# Altium schematic sheet Microcontroller_sch_v22_4.SchDoc
size 286 x 127 mm; Origin: Eagle
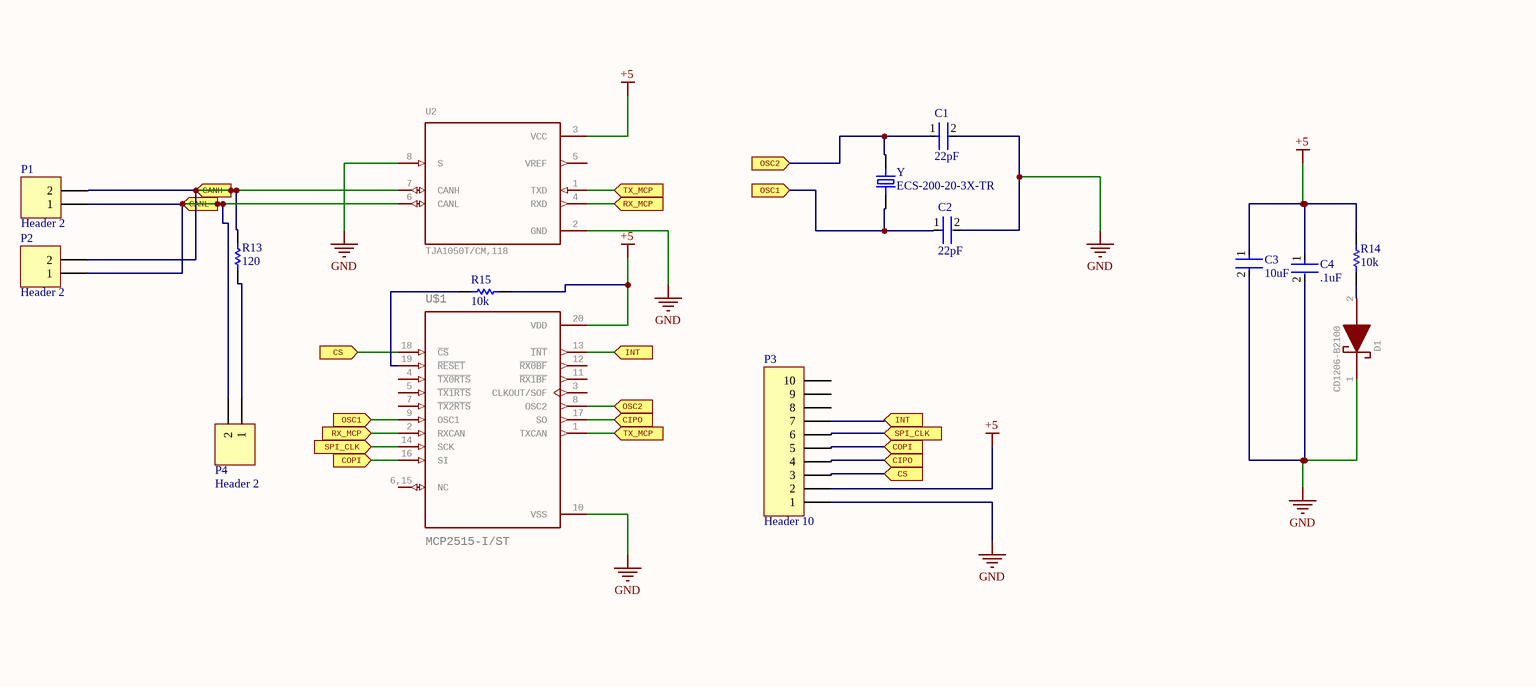
[diagram p0: Microcontroller_sch_v22_4.SchDoc]

## Parts
C1  22pF  [FP-GRM21B-0_15-IPC_C]
C2  22pF  [FP-GRM21B-0_15-IPC_C]
C3  10uF  [FP-GRM21B-0_15-IPC_C]
C4  .1uF  [FP-GRM21B-0_15-IPC_C]
D1  CD1206-B2100  [DIOC3419X116N]
P1  Header 2  [HDR1X2]
P2  Header 2  [HDR1X2]
P3  Header 10  [HDR1X10]
P4  Header 2  [HDR1X2]
R13  120  [RESC2013X50X30LL20T20]
R14  10k  [RESC2013X50X30LL20T20]
R15  10k  [RESC2013X50X30LL20T20]
U2  TJA1050T/CM,118  [SOIC127P600X175-8N]
U$1  MCP2515-I/ST  [SOP65P640X110-20N]
Y  ECS-200-20-3X-TR  [XTAL_ECS-200-20-3X-TR]

## Ports
CANH (in, see Microcontroller_sch_v22_2[4B]), CANL (in, see Microcontroller_sch_v22_2[4B]), CIPO (in, see Microcontroller_sch_v22_0[1B], Microcontroller_sch_v22_1[1B], Microcontroller_sch_v22_1[5C], Microcontroller_sch_v22_4[3C]), CIPO (in, see Microcontroller_sch_v22_0[1B], Microcontroller_sch_v22_1[1B], Microcontroller_sch_v22_1[5C], Microcontroller_sch_v22_4[4C]), COPI (in, see Microcontroller_sch_v22_0[1B], Microcontroller_sch_v22_1[1B], Microcontroller_sch_v22_1[5C], Microcontroller_sch_v22_4[2C]), COPI (in, see Microcontroller_sch_v22_0[1B], Microcontroller_sch_v22_1[1B], Microcontroller_sch_v22_1[5C], Microcontroller_sch_v22_4[4C]), CS (in, see Microcontroller_sch_v22_4[2C]), CS (in, see Microcontroller_sch_v22_4[4C]), INT (in, see Microcontroller_sch_v22_4[3C]), INT (in, see Microcontroller_sch_v22_4[4C]), OSC1 (in, see Microcontroller_sch_v22_4[2C]), OSC1 (in, see Microcontroller_sch_v22_4[3B]), OSC2 (in, see Microcontroller_sch_v22_4[3A]), OSC2 (in, see Microcontroller_sch_v22_4[3C]), RX_MCP (in, see Microcontroller_sch_v22_4[2C]), RX_MCP (in, see Microcontroller_sch_v22_4[3B]), SPI_CLK (in, see Microcontroller_sch_v22_0[1B], Microcontroller_sch_v22_1[0B], Microcontroller_sch_v22_1[4C], Microcontroller_sch_v22_2[4B], Microcontroller_sch_v22_4[2C]), SPI_CLK (in, see Microcontroller_sch_v22_0[1B], Microcontroller_sch_v22_1[0B], Microcontroller_sch_v22_1[4C], Microcontroller_sch_v22_2[4B], Microcontroller_sch_v22_4[4C]), TX_MCP (in, see Microcontroller_sch_v22_4[3B]), TX_MCP (in, see Microcontroller_sch_v22_4[3C])

## Nets
+5: C3.1 C4.1 P3.2 R14.1 R15.1 U2.3(VCC) U$1.20(VDD)
GND: C1.2 C2.2 C3.2 C4.2 D1.1(K) P3.1 U2.2(GND) U2.8(S) U$1.10(VSS)
CANH: P1.2 P2.2 R13.2 U2.7(CANH) ; port CANH
CANL: P1.1 P2.1 P4.2 U2.6(CANL) ; port CANL
CIPO: P3.4 U$1.17(SO) ; port CIPO
COPI: P3.5 U$1.16(SI) ; port COPI
CS: P3.3 U$1.18(~{CS}) ; port CS
INT: P3.7 U$1.13(~{INT}) ; port INT
OSC1: C2.1 U$1.9(OSC1) Y.1 ; port OSC1
OSC2: C1.1 U$1.8(OSC2) Y.2 ; port OSC2
RX_MCP: U2.4(RXD) U$1.2(RXCAN) ; port RX_MCP
SPI_CLK: P3.6 U$1.14(SCK) ; port SPI_CLK
TX_MCP: U2.1(TXD) U$1.1(TXCAN) ; port TX_MCP
NetD1_2: D1.2(A) R14.2
NetP4_1: P4.1 R13.1
NetR15_2: R15.2 U$1.19(~{RESET})

Not connected (* = marked no-connect by the designer): P3 8 9 10; U2 5(VREF); U$1 3(CLKOUT/SOF) 4(~{TX0RTS}) 5(~{TX1RTS}) 6,15(NC) 7(~{TX2RTS}) 11(~{RX1BF}) 12(~{RX0BF})

## Library data of the parts
C1-C4 = CMP-2007-03541-2: Chip Multilayer Ceramic Capacitors for General Purpose, 0805, 10uF, X5R, 15%, 10%, 25V; Length: 2mm; Depth: 1.25mm; Termination: SMD/SMT; Voltage: 25V; Height: 1.25mm; Material: Ceramic; Thickness: 0.053inch; Radiation Hardening: No; Min Operating Temperature: -55°C; Width: 0.049inch; Package Quantity: 1; Mount: Surface Mount; Dielectric: X5R; Packaging: Tape and Reel; Capacitance: 10uF; Voltage Rating (DC): 25V; Lead Free: Lead Free; Max Operating Temperature: 85°C; Case Code (Imperial): 0805; Case/Package: 0805; Tolerance: 10%; Voltage Rating: 25V; Case Code (Metric): 2012
D1 = CD1206-B2100: Schottky Diodes & Rectifiers CHIP DIODE   Source:  Datasheet; MANUFACTURER_NAME: Bourns; GateName_1: G$1; SymbolName_1: CD1206-B2100; LibraryName: CD1206-B2100; DeviceSetName: CD1206-B2100; HEIGHT: 1.16mm; MANUFACTURER_PART_NUMBER: CD1206-B2100; MOUSER_PART_NUMBER: 652-CD1206-B2100; MOUSER_PRICE-STOCK: https://www.mouser.co.uk/ProductDetail/Bourns/CD1206-B2100?qs=VNGG2InBe5EQUAtP9HPU9g%3D%3D
P1 P2 P4 = Header 2: Header, 2-Pin; LatestRevisionDate: 17-Jul-2002; LatestRevisionNote: Re-released for DXP Platform.; Publisher: Altium Limited
P3 = Header 10: Header, 10-Pin; LatestRevisionDate: 17-Jul-2002; LatestRevisionNote: Re-released for DXP Platform.; Publisher: Altium Limited
R13-R15 = CMP-2001-04896-1: Manufacturer: Vishay Dale; Part Number: CRCW08050000Z0EA
U2 = TJA1050T/CM,118: 1/1 Transceiver Half CANbus 8-SO; MANUFACTURER: NXP USA; GateName_1: G$1; SymbolName_1: TJA1050T/CM,118; LibraryName: TJA1050T_CM_118; DeviceSetName: TJA1050T/CM,118; MAXIMUM_PACKAGE_HEIGHT: 1.75 mm; PARTREV: 4; STANDARD: IPC 7351B
U$1 = MCP2515-I/ST: Check availability; GateName_1: A; MF: Microchip; SymbolName_1: MCP2515-I/ST; LibraryName: MCP2515-I_ST; DeviceSetName: MCP2515-I/ST; AVAILABILITY: In Stock; MP: MCP2515-I/ST; PACKAGE: TSSOP-20 Microchip; PRICE: None; PURCHASE-URL: https://pricing.snapeda.com/search/part/MCP2515-I/ST/?ref=eda
Y = ECS-200-20-3X-TR: 20MHz Â± 30ppm Cristal 20pF 50 Ohms HC-49 / US; MF: ECS Inc.; Value: *; Digi-Key_Purchase_URL: https://www.digikey.com/product-detail/en/ecs-inc/ECS-200-20-3X-TR/XC1779CT-ND/2676643?utm_source=snapeda&utm_medium=aggregator&utm_campaign=symbol; Package: HC49/US ECS International; Digi-Key_Part_Number: XC1779CT-ND; MP: ECS-200-20-3X-TR; SnapEDA_Link: https://www.snapeda.com/parts/ECS-200-20-3X-TR/ECS%20Inc./view-part/2455740/?ref=snap